# EAGLE schematic EEZ CF-DIC r5B5 (EAGLE 7.2.0)
Assembly variants: Farnell, TME

## Sheet 1 of 3
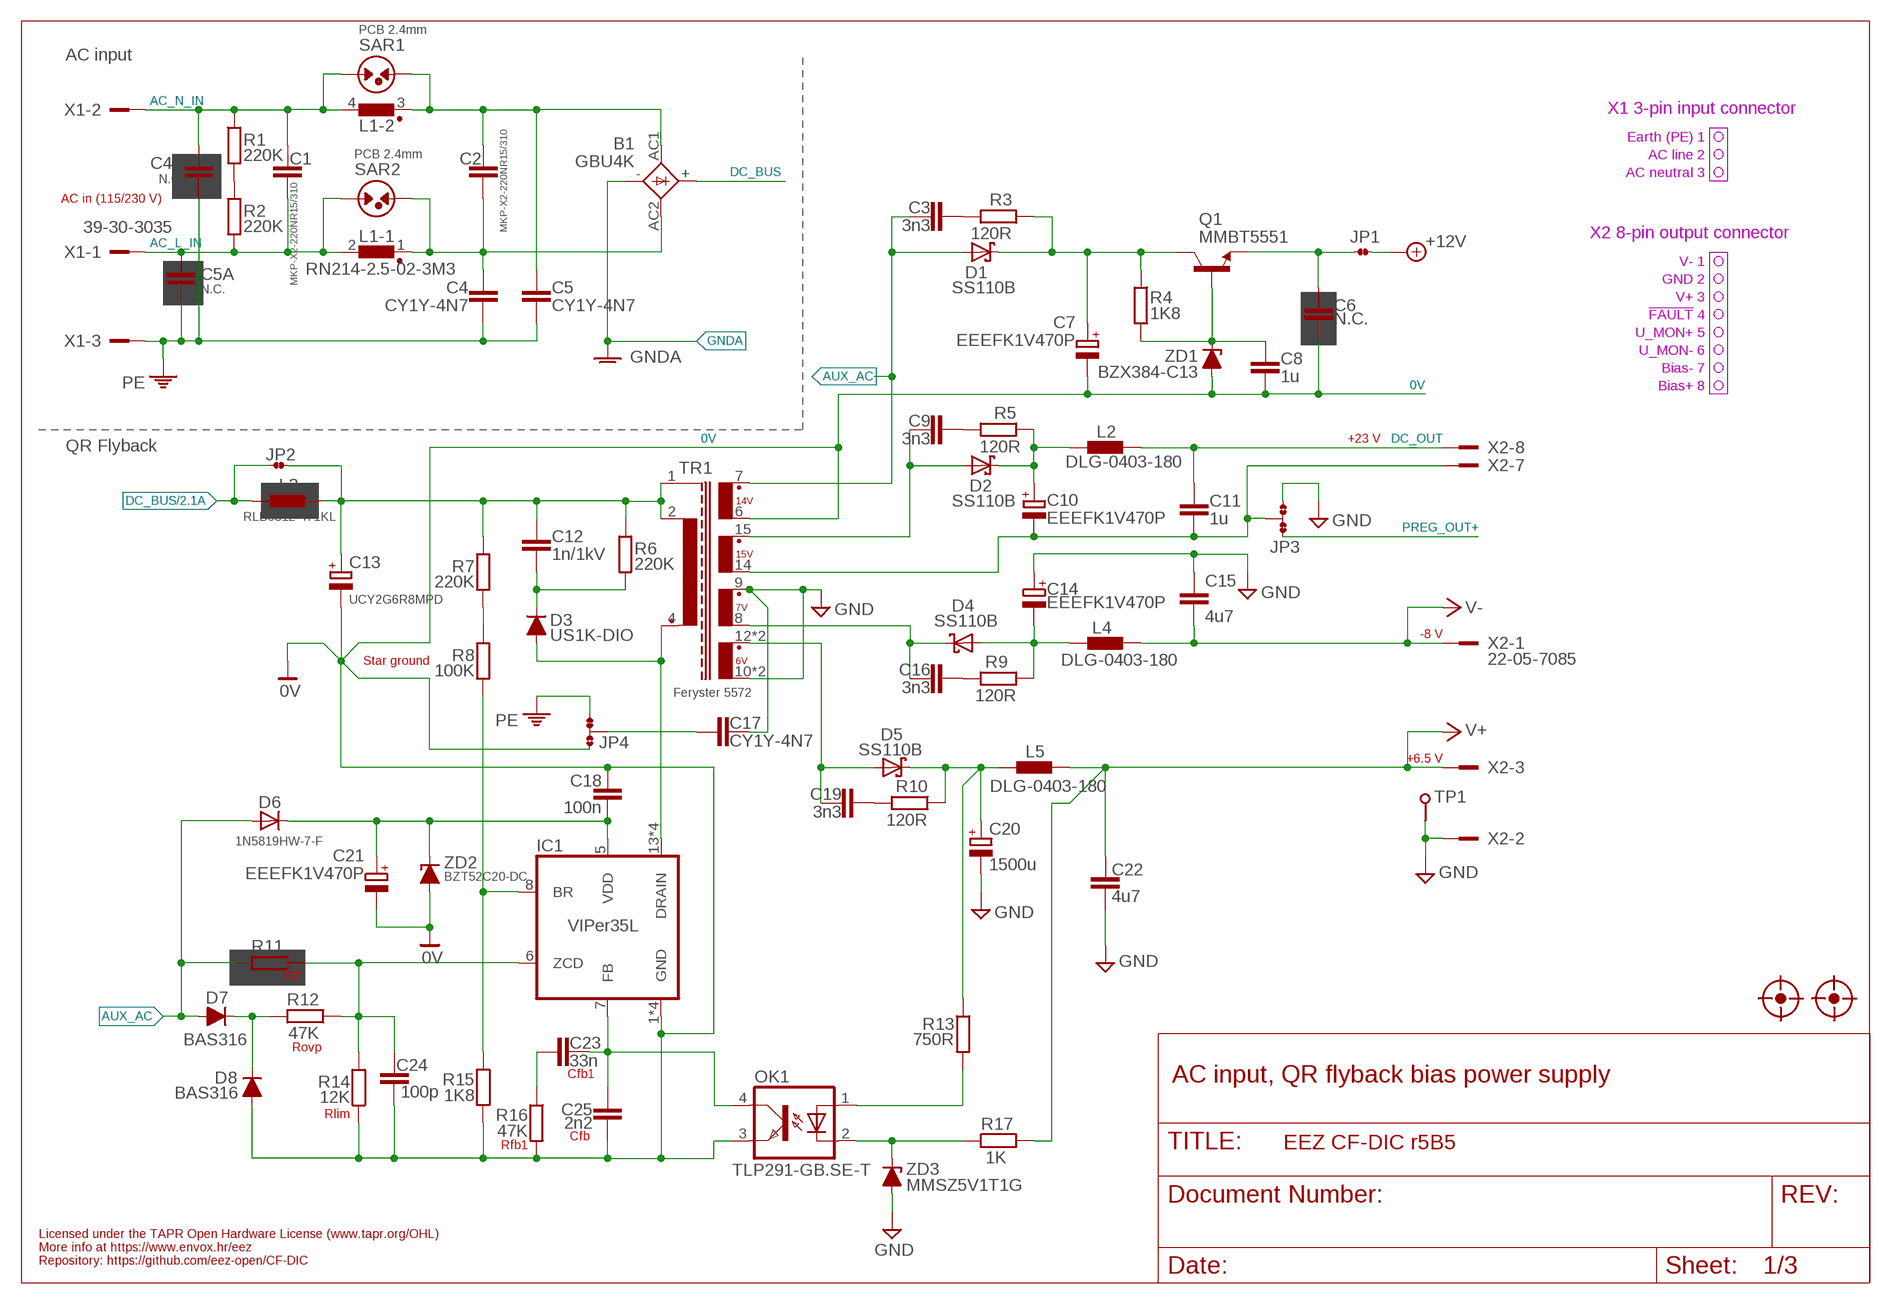
[diagram p0: schematic, sheet 1]

### Parts
B1  GBU4K  BRIDGE-CREEPAGE  [GBU4K_CRE]
C1  MKP-X2-220NR15/310  C-EU150-072X183  [C150-072X183]
C2  MKP-X2-220NR15/310  C-EU150-072X183  [C150-072X183]
C3  3n3  C-EUC0805  [C0805]
C4  CY1Y-4N7  C-EUCY  [CY075-032X103]
C4A  N.C.  C-EUCY-ROTATED  [CY075-032X103-ROTATED]
C5  CY1Y-4N7  C-EUCY  [CY075-032X103]
C5A  N.C.  C-EUCY  [CY075-032X103]
C6  N.C.  C-EUC0603  [C0603]
C7  EEEFK1V470P  ECAPPANASONIC_H  [CAPAE660X610N]
C8  1u  C-EUC0805  [C0805]
C9  3n3  C-EUC0805  [C0805]
C10  EEEFK1V470P  ECAPPANASONIC_H  [CAPAE660X610N]
C11  1u  C-EUC0805  [C0805]
C12  1n/1kV  C-EUC1210  [C1210]
C13  UCY2G6R8MPD  ECAP5G_10.5MM  [ECAP5/10.5]
C14  EEEFK1V470P  ECAPPANASONIC_H  [CAPAE660X610N]
C15  4u7  C-EUC1206  [C1206]
C16  3n3  C-EUC0805  [C0805]
C17  CY1Y-4N7  C-EUCY  [CY075-032X103]
C18  100n  C-EUC0603  [C0603]
C19  3n3  C-EUC0805  [C0805]
C20  1500u  ECAP5G_13MM  [ECAP5/13]
C21  EEEFK1V470P  ECAPPANASONIC_H  [CAPAE660X610N]
C22  4u7  C-EUC1206  [C1206]
C23  33n  C-EUC0805  [C0805]
C24  100p  C-EUC0805  [C0805]
C25  2n2  C-EUC0805  [C0805]
D1  SS110B  SCHOTTKYSMB  [SMB]
D2  SS110B  SCHOTTKYSMB  [SMB]
D3  US1K-DIO  DIODEDO214AA  [DO214AA]
D4  SS110B  SCHOTTKYSMB  [SMB]
D5  SS110B  SCHOTTKYSMB  [SMB]
D6  1N5819HW-7-F  DIODE-SOD323-W  [SOD323-W]
D7  BAS316  DIODESOD323R  [SOD323-R]
D8  BAS316  DIODESOD323R  [SOD323-R]
FM1  FIDUCIAL_2  [FIDUCIAL_DUAL]
FM2  FIDUCIAL_2  [FIDUCIAL_DUAL]
IC1  VIPer35L  VIPER35  [SOIC-16]
JP1  JP2-NOCUT  [JP2-NOCUT]
JP2  JP2-NOCUT  [JP2-NOCUT]
JP3  JP3-CUT  [JP3-CUT]
JP4  JP3-CUT  [JP3-CUT]
L1  RN214-2.5-02-3M3  RN214  [RN214]
L2  DLG-0403-180  DE0403  [DE0403]
L3  RLB0812-471KL  FERYSTER_DSZ6  [FERSYTER_DSZ6]
L4  DLG-0403-180  DE0403  [DE0403]
L5  DLG-0403-180  DE0403  [DE0403]
OK1  TLP291-GB.SE-T  TLP291  [SO4]
Q1  MMBT5551  MMBT5551LT1-NPN-SOT23-BEC  [SOT23-BEC]
R1  220K  R-EU_R1206  [R1206]
R2  220K  R-EU_R1206  [R1206]
R3  120R  R-EU_R0805  [R0805]
R4  1K8  R-EU_R0805  [R0805]
R5  120R  R-EU_R0805  [R0805]
R6  220K  R-EU_R1206  [R1206]
R7  220K  R-EU_R1206  [R1206]
R8  100K  R-EU_R0805  [R0805]
R9  120R  R-EU_R0805  [R0805]
R10  120R  R-EU_R0805  [R0805]
R11  N.C.  R-EU_R0805  [R0805]
R12  47K  R-EU_R0805  [R0805]
R13  750R  R-EU_R0805  [R0805]
R14  12K  R-EU_R0805  [R0805]
R15  1K8  R-EU_R0805  [R0805]
R16  47K  R-EU_R0805  [R0805]
R17  1K  R-EU_R0805  [R0805]
SAR1  PCB 2.4mm  SARPCB-2.4MM  [PCB-SAR_2.4MM]
SAR2  PCB 2.4mm  SARPCB-2.4MM  [PCB-SAR_2.4MM]
TP1  PCB_TEST_TABSHIELD  [PCB_SHIELD_TAB]
TR1  Feryster 5572  FERYSTER_5572  [FERYSTER_5572]
X1  39-30-3035  MINIFIT_6659-3-CRE  [MINIFIT_6659-3_CRE]
X2  22-05-7085  SPOX_22-05-7085  [SPOX_22-05-7085]
ZD1  BZX384-C13  ZENER-DIODESOD323  [SOD323-W]
ZD2  BZT52C20-DC  ZENER-DIODESOD123  [SOD123]
ZD3  MMSZ5V1T1G  ZENER-DIODESOD323  [SOD323-W]

### Nets
0V: C6.2 C7.2(-) C8.2 C13.- C18.1 C21.2(-) C24.2 C25.2 D8.A IC1.1(GND) IC1.2(GND) IC1.3(GND) IC1.4(GND) JP4.NO OK1.3(EMIT) R14.1 R15.2 R16.2 TR1.6(S_BIAS) ZD1.A ZD2.A ; also sheet 2
6VAC: C19.2 D5.A TR1.12(S1_DOT) TR1.13(S1_DOT)
7VAC: C16.2 D4.C TR1.8(S2)
15VAC: C9.2 D2.A TR1.15(S3_DOT)
+6V_REC: C20.+ D5.C L5.1 R10.1 R13.1
+12V: JP1.2 ; also sheet 2
+15V_REC: C10.1(+) D2.C L2.1 R5.1
-7V_REC: C14.2(-) D4.A L4.1 R9.1
-15V: C10.2(-) C11.2 JP3.COM TR1.14(S3) X2.7
AC_L_IN: C1.2 C5A.2 L1.2 R2.2 SAR2.1 X1.1
AC_N_IN: C1.1 C4A.2 L1.4 R1.1 SAR1.1 X1.2
AUX_AC: C3.2 D1.A D6.A D7.A R11.2 TR1.7(S_BIAS_DOT)
AUX_REC: C7.1(+) D1.C Q1.C R3.1 R4.1
DC_BUS: B1.+ JP2.1 L3.P$1 ; also sheet 2
DC_OUT: C11.1 L2.2 X2.8
FB2: OK1.2(C) R17.1 ZD3.C
GND: C14.1(+) C15.1 C17.2 C20.- C22.2 JP3.NO TP1.1 TR1.9(S2_DOT) TR1.10(S1) TR1.11(S1) X2.2 ZD3.A ; also sheet 2,3
GNDA: B1.- ; also sheet 2
N$4: C17.1 JP4.COM
N$20: IC1.8(BR) R8.2 R15.1
N$24: C6.1 JP1.1 Q1.E
N$27: C18.2 C21.1(+) D6.C IC1.5(VDD) ZD2.C
N$33: R1.2 R2.1
N$41: B1.AC1 C2.1 C5.2 L1.3 SAR1.2
N$43: B1.AC2 C2.2 C4.2 L1.1 SAR2.2
N$49: R7.2 R8.1
N$133: C8.1 Q1.B R4.2 ZD1.C
N$135: OK1.1(A) R13.2
N$137: C12.2 D3.C R6.2
N$138: C23.2 C25.1 IC1.7(FB) OK1.4(COL)
N$139: C9.1 R5.2
N$140: C3.1 R3.2
N$141: C24.1 IC1.6(ZCD) R11.1 R12.1 R14.2
N$144: C16.1 R9.2
N$146: C19.1 R10.2
N$152: C23.1 R16.1
N$155: D7.C D8.C R12.2
PE: C4.1 C4A.1 C5.1 C5A.1 JP4.NC X1.3 ; also sheet 3
PREG_OUT+: JP3.NC ; also sheet 3
V+: C22.1 L5.2 R17.2 X2.3 ; also sheet 3
V-: C15.2 L4.2 X2.1 ; also sheet 3
VIPER+: C12.1 C13.+ JP2.2 L3.P$2 R6.1 R7.1 TR1.1(SHIELD) TR1.2(P)
VIPER_D: D3.A IC1.13(DRAIN) IC1.14(DRAIN) IC1.15(DRAIN) IC1.16(DRAIN) TR1.4(P2_DOT)

### Notes on the sheet
- AC input
- X1 3-pin input connector
- Earth (PE) 1
- AC line 2
- AC neutral 3
- AC in (115/230 V)
- X2 8-pin output connector
- V- 1
- GND 2
- V+ 3
- !FAULT! 4
- U_MON+ 5
- U_MON- 6
- Bias- 7
- Bias+ 8
- +23 V
- QR Flyback
- -8 V
- Star ground
- +6.5 V
- Rff
- Rovp
- Cfb1
- AC input, QR flyback bias power supply
- Rlim
- Cfb
- Rfb1
- Licensed under the TAPR Open Hardware License (www.tapr.org/OHL)
- More info at https://www.envox.hr/eez
- Repository: https://github.com/eez-open/CF-DIC

## Sheet 2 of 3
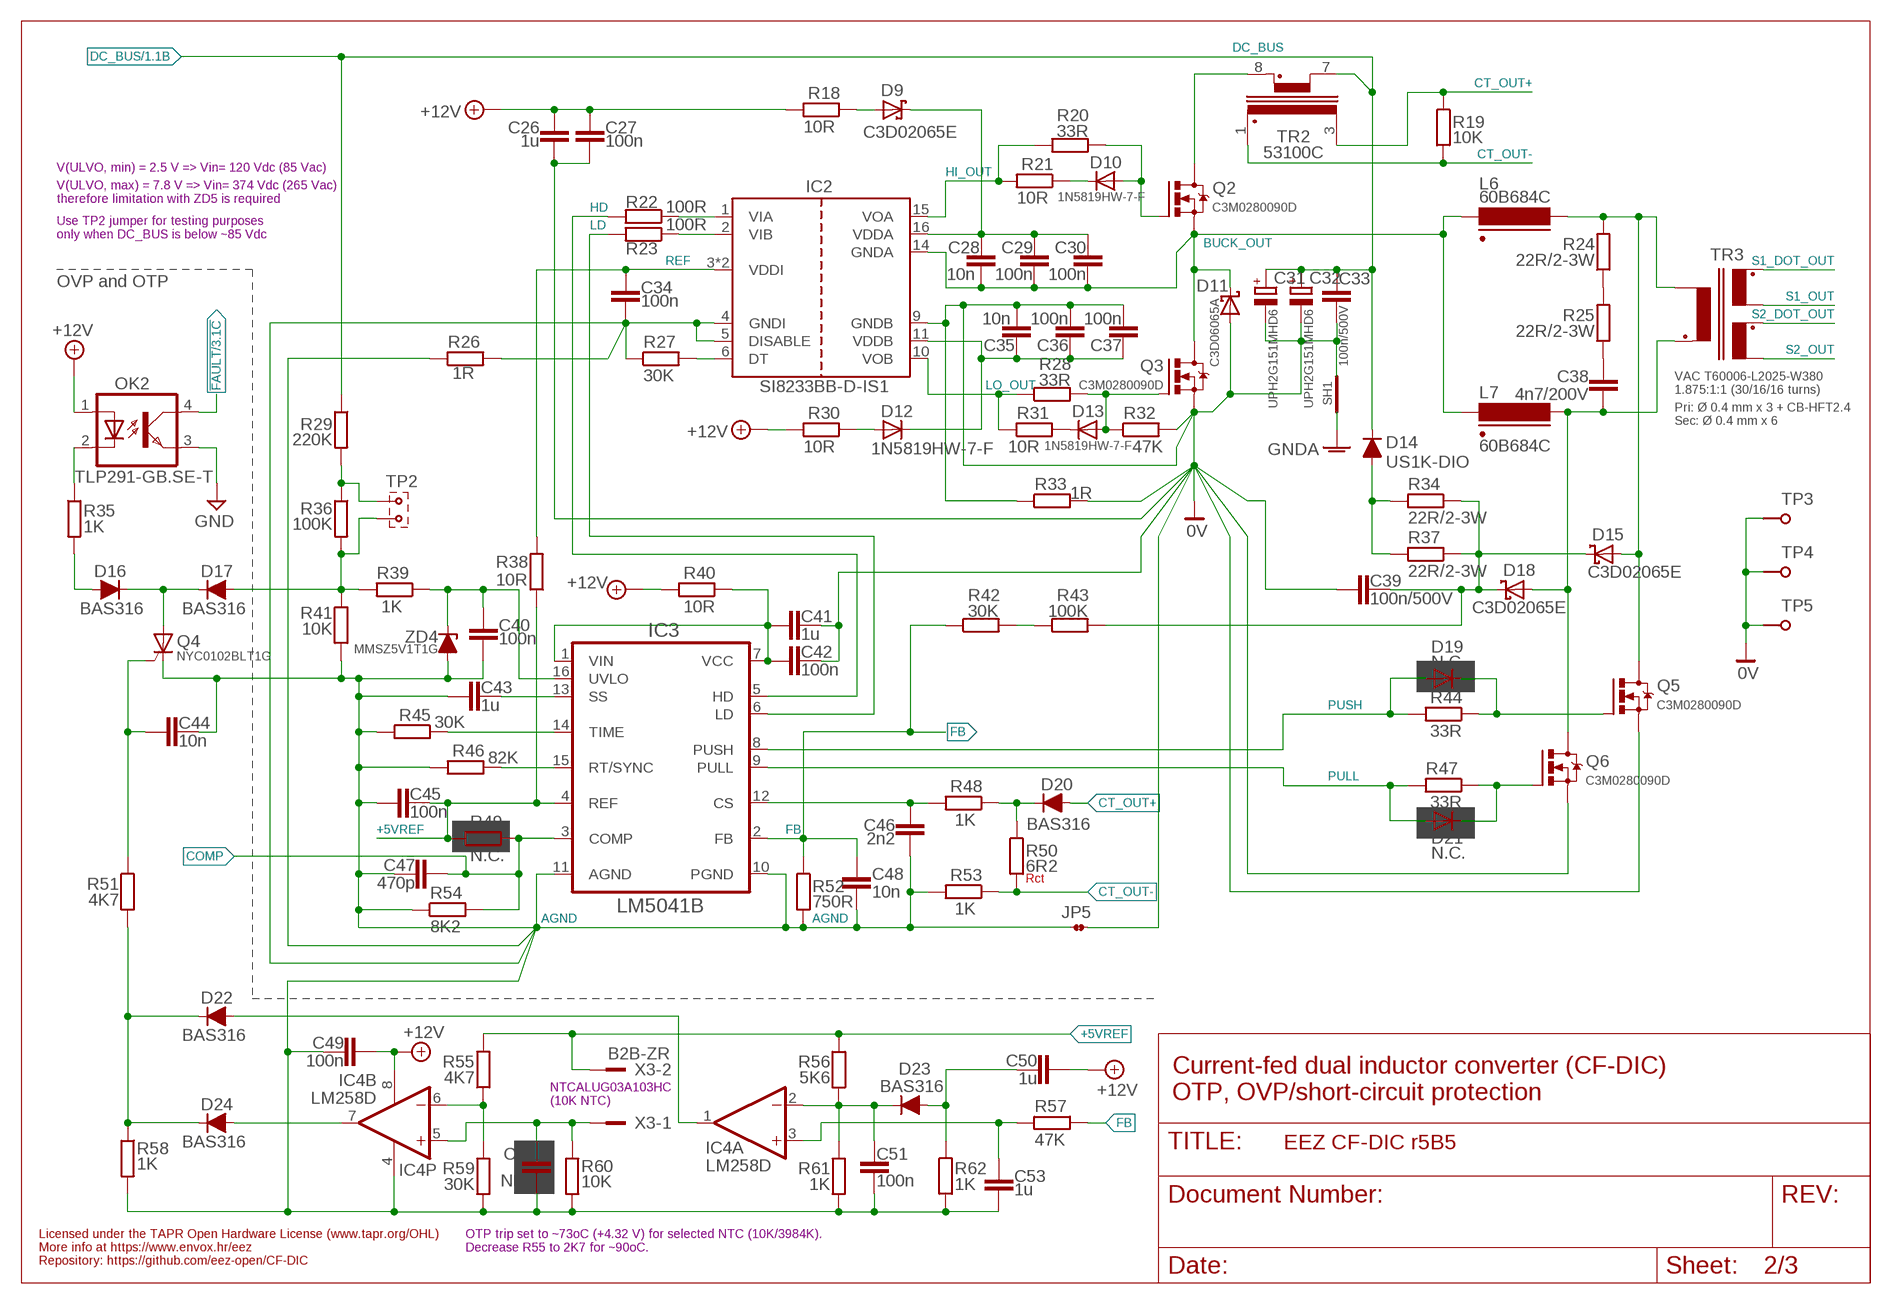
[diagram p1: schematic, sheet 2]

### Parts
C26  1u  C-EUC0805  [C0805]
C27  100n  C-EUC0603  [C0603]
C28  10n  C-EUC0603  [C0603]
C29  100n  C-EUC0603  [C0603]
C30  100n  C-EUC0603  [C0603]
C31  UPH2G151MHD6  ECAP7.5G_18MM  [ECAP7.5/18]
C32  UPH2G151MHD6  ECAP7.5G_18MM  [ECAP7.5/18]
C33  100n/500V  C-EUC1812  [C1812]
C34  100n  C-EUC0603  [C0603]
C35  10n  C-EUC0603  [C0603]
C36  100n  C-EUC0603  [C0603]
C37  100n  C-EUC0603  [C0603]
C38  4n7/200V  C-EUC1210  [C1210]
C39  100n/500V  C-EUC1812  [C1812]
C40  100n  C-EUC0603  [C0603]
C41  1u  C-EUC0805  [C0805]
C42  100n  C-EUC0603  [C0603]
C43  1u  C-EUC0805  [C0805]
C44  10n  C-EUC0603  [C0603]
C45  100n  C-EUC0603  [C0603]
C46  2n2  C-EUC0805  [C0805]
C47  470p  C-EUC0805  [C0805]
C48  10n  C-EUC0603  [C0603]
C49  100n  C-EUC0603  [C0603]
C50  1u  C-EUC0805  [C0805]
C51  100n  C-EUC0603  [C0603]
C52  N.C.  C-EUC0603  [C0603]
C53  1u  C-EUC0805  [C0805]
D9  C3D02065E  SCHOTTKY-SIC  [TO252]
D10  1N5819HW-7-F  DIODE-SOD323-W  [SOD323-W]
D11  C3D06065A  SCHOTTKY-TO220  [TO220-2]
D12  1N5819HW-7-F  DIODE-SOD323-W  [SOD323-W]
D13  1N5819HW-7-F  DIODE-SOD323-W  [SOD323-W]
D14  US1K-DIO  DIODEDO214AA  [DO214AA]
D15  C3D02065E  SCHOTTKY-SIC  [TO252]
D16  BAS316  DIODESOD323R  [SOD323-R]
D17  BAS316  DIODESOD323R  [SOD323-R]
D18  C3D02065E  SCHOTTKY-SIC  [TO252]
D19  N.C.  DIODE-SOD323-W  [SOD323-W]
D20  BAS316  DIODESOD323R  [SOD323-R]
D21  N.C.  DIODE-SOD323-W  [SOD323-W]
D22  BAS316  DIODESOD323R  [SOD323-R]
D23  BAS316  DIODESOD323R  [SOD323-R]
D24  BAS316  DIODESOD323R  [SOD323-R]
IC2  SI8233BB-D-IS1  SI8233  [SOIC-16]
IC3  LM5041B  LM5041  [MTC16]
IC4  LM258D  TL072SOIC8  [SOIC127P600X173-8N]
JP5  JP2-NOCUT  [JP2-NOCUT]
L6  60B684C  MURATA_6000B  [MURATA_6000B]
L7  60B684C  MURATA_6000B  [MURATA_6000B]
OK2  TLP291-GB.SE-T  TLP291  [SO4]
Q2  C3M0280090D  IRFP240  [TO247BV]
Q3  C3M0280090D  IRFP240  [TO247BV]
Q4  NYC0102BLT1G  [SOT23]
Q5  C3M0280090D  IRFP240  [TO247BV]
Q6  C3M0280090D  IRFP240  [TO247BV]
R18  10R  R-EU_R0805  [R0805]
R19  10K  R-EU_R0805  [R0805]
R20  33R  R-EU_R0805  [R0805]
R21  10R  R-EU_R0805  [R0805]
R22  100R  R-EU_R0805  [R0805]
R23  100R  R-EU_R0805  [R0805]
R24  22R/2-3W  R-EU_R2512  [R2512]
R25  22R/2-3W  R-EU_R2512  [R2512]
R26  1R  R-EU_R0805  [R0805]
R27  30K  R-EU_R0805  [R0805]
R28  33R  R-EU_R0805  [R0805]
R29  220K  R-EU_R1206  [R1206]
R30  10R  R-EU_R0805  [R0805]
R31  10R  R-EU_R0805  [R0805]
R32  47K  R-EU_R0805  [R0805]
R33  1R  R-EU_R0805  [R0805]
R34  22R/2-3W  R-EU_R2512  [R2512]
R35  1K  R-EU_R0805  [R0805]
R36  100K  R-EU_R0805  [R0805]
R37  22R/2-3W  R-EU_R2512  [R2512]
R38  10R  R-EU_R0805  [R0805]
R39  1K  R-EU_R0805  [R0805]
R40  10R  R-EU_R0805  [R0805]
R41  10K  R-EU_R0805  [R0805]
R42  30K  R-EU_R0805  [R0805]
R43  100K  R-EU_R0805  [R0805]
R44  33R  R-EU_R0805  [R0805]
R45  30K  R-EU_R0805  [R0805]
R46  82K  R-EU_R0805  [R0805]
R47  33R  R-EU_R0805  [R0805]
R48  1K  R-EU_R0805  [R0805]
R49  N.C.  R-EU_R0805  [R0805]
R50  6R2  R-EU_R0805  [R0805]
R51  4K7  R-EU_R0805  [R0805]
R52  750R  R-EU_R0805  [R0805]
R53  1K  R-EU_R0805  [R0805]
R54  8K2  R-EU_R0805  [R0805]
R55  4K7  R-EU_R0805  [R0805]
R56  5K6  R-EU_R0805  [R0805]
R57  47K  R-EU_R0805  [R0805]
R58  1K  R-EU_R0805  [R0805]
R59  30K  R-EU_R0805  [R0805]
R60  10K  R-EU_R0805  [R0805]
R61  1K  R-EU_R0805  [R0805]
R62  1K  R-EU_R0805  [R0805]
SH1  SHORTNOHOLE  [SHORT_NOHOLE]
TP2  JUMPER-2PIN-2MM  [2MM-2]
TP3  TEST-PIN1.2  [TEST-PIN_1.2MM]
TP4  TEST-PIN1.2  [TEST-PIN_1.2MM]
TP5  TEST-PIN1.2  [TEST-PIN_1.2MM]
TR2  53100C  MURATA_5300  [MURATA_5300]
TR3  VAC T60006-L2025-W380  PCB_TRAFO_FLYBACK2-VAC  [VAC_DUAL_SEC]
X3  B2B-ZR  [B2B-ZR]
ZD4  MMSZ5V1T1G  ZENER-DIODESOD323  [SOD323-W]

### Nets
0V: C26.1 C27.1 C31.- C32.- C33.2 C35.2 C36.2 C37.2 C39.1 C41.2 C42.2 D11.2(A) IC2.9(GNDB) JP5.2 Q3.S Q5.S Q6.S R32.2 R33.1 R33.2 SH1.P$2(GND_B) TP3.1 TP4.1 TP5.1 ; also sheet 1
!FAULT: OK2.4(COL) ; also sheet 3
+5VREF: C45.2 IC3.4(REF) R38.1 R49.1 R55.2 R56.2 X3.2
+12V: C26.2 C27.2 C49.1 C50.1 IC4.8(P:V+) OK2.1(A) R18.2 R30.2 R40.2 ; also sheet 1
AGND: C34.1 C40.2 C43.1 C44.2 C45.1 C46.1 C47.1 C48.2 C49.2 C51.2 C52.1 C53.1 IC2.4(GNDI) IC2.5(DISABLE) IC3.10(PGND) IC3.11(AGND) IC4.4(P:V-) JP5.1 Q4.1(C) R26.1 R26.2 R27.1 R41.2 R45.2 R46.2 R52.2 R53.2 R54.1 R58.2 R59.2 R60.2 R61.2 R62.2 ZD4.A ; also sheet 3
BUCK_OUT: C28.2 C29.2 C30.2 D11.1(C) IC2.14(GNDA) L6.2 L7.2 Q2.S Q3.D
CLAMP_C: C39.2 D15.1(C) D15.3(C) D18.1(C) D18.3(C) R34.1 R37.1 R43.2
COMP: C47.2 IC3.3(COMP) R49.2 R54.2 ; also sheet 3
CT_OUT+: D20.A R19.1 TR2.3(S)
CT_OUT-: R19.2 R50.2 R53.1 TR2.1(S_DOT)
DC_BUS: C31.+ C32.+ C33.1 D14.C R29.1 TR2.7(P) ; also sheet 1
FB: C48.1 IC3.2(FB) R42.1 R52.1 R57.1
GND: OK2.3(EMIT) ; also sheet 1,3
GNDA: SH1.P$1(GND_A) ; also sheet 1
HD: IC3.5(HD) R22.2
HI_OUT: IC2.15(VOA) R20.2 R21.2
L_PULL: C38.2 D18.2(A) L7.1 Q6.D TR3.P1_DOT(P_DOT)
L_PUSH: D15.2(A) L6.1 Q5.D R24.2 TR3.P1(P)
LD: IC3.6(LD) R23.2
LO_OUT: IC2.10(VOB) R28.1 R31.1
N$2: R29.2 R36.1 TP2.1
N$3: C28.1 C29.1 C30.1 D9.1(C) D9.3(C) IC2.16(VDDA)
N$5: R24.1 R25.2
N$7: C51.1 D23.C IC4.2(A:-IN) R56.1 R61.1
N$13: D19.C Q5.G R44.1
N$14: D21.C Q6.G R47.1
N$15: Q2.D TR2.8(P_DOT)
N$17: C38.1 R25.1
N$19: IC3.15(RT/SYNC) R46.1
N$21: D10.A Q2.G R20.1
N$22: IC3.14(TIME) R45.1
N$23: C43.2 IC3.13(SS)
N$25: C40.1 IC3.16(UVLO) R39.1 ZD4.C
N$26: IC4.6(B:-IN) R55.1 R59.1
N$29: D13.A Q3.G R28.2 R32.1
N$30: R42.2 R43.1
N$31: D9.2(A) R18.1
N$32: OK2.2(C) R35.1
N$34: C53.2 IC4.3(A:+IN) R57.2
N$35: D14.A R34.2 R37.2
N$36: IC2.1(VIA) R22.1
N$37: C46.2 IC3.12(CS) R48.2
N$38: D22.A IC4.1(A:OUT)
N$40: IC2.2(VIB) R23.1
N$42: C52.2 IC4.5(B:+IN) R60.1 X3.1
N$45: D10.C R21.1
N$47: D24.A IC4.7(B:OUT)
N$48: IC2.6(DT) R27.2
N$51: D22.C D24.C R51.2 R58.1
N$52: D13.C R31.2
N$54: C41.1 C42.1 IC3.1(VIN) IC3.7(VCC) R40.1
N$55: C35.1 C36.1 C37.1 D12.C IC2.11(VDDB)
N$56: D20.C R48.1 R50.1
N$59: C50.2 D23.A R62.1
N$63: D12.A R30.1
N$100: C44.1 Q4.2(G) R51.1
N$126: D16.C D17.C Q4.3(A)
N$130: D16.A R35.2
PULL: D21.A IC3.9(PULL) R47.2
PUSH: D19.A IC3.8(PUSH) R44.2
REF: C34.2 IC2.3(VDDI) IC2.8(VDDI) R38.2
S1_DOT_OUT: TR3.S1_DOT ; also sheet 3
S1_OUT: TR3.S1 ; also sheet 3
S2_DOT_OUT: TR3.S2_DOT ; also sheet 3
S2_OUT: TR3.S2 ; also sheet 3
ULVO: D17.A R36.2 R39.2 R41.1 TP2.2

### Notes on the sheet
- V(ULVO, min) = 2.5 V => Vin= 120 Vdc (85 Vac)
- V(ULVO, max) = 7.8 V => Vin= 374 Vdc (265 Vac)
  therefore limitation with ZD5 is required
- Use TP2 jumper for testing purposes
  only when DC_BUS is below ~85 Vdc
- OVP and OTP
- 1.875:1:1 (30/16/16 turns)
- Pri: Ø 0.4 mm x 3 + CB-HFT2.4
- Sec: Ø 0.4 mm x 6
- Rct
- Current-fed dual inductor converter (CF-DIC)
  OTP, OVP/short-circuit protection
- NTCALUG03A103HC
  (10K NTC)
- OTP trip set to ~73oC (+4.32 V) for selected NTC (10K/3984K).
  Decrease R55 to 2K7 for ~90oC.
- Licensed under the TAPR Open Hardware License (www.tapr.org/OHL)
- More info at https://www.envox.hr/eez
- Repository: https://github.com/eez-open/CF-DIC

## Sheet 3 of 3
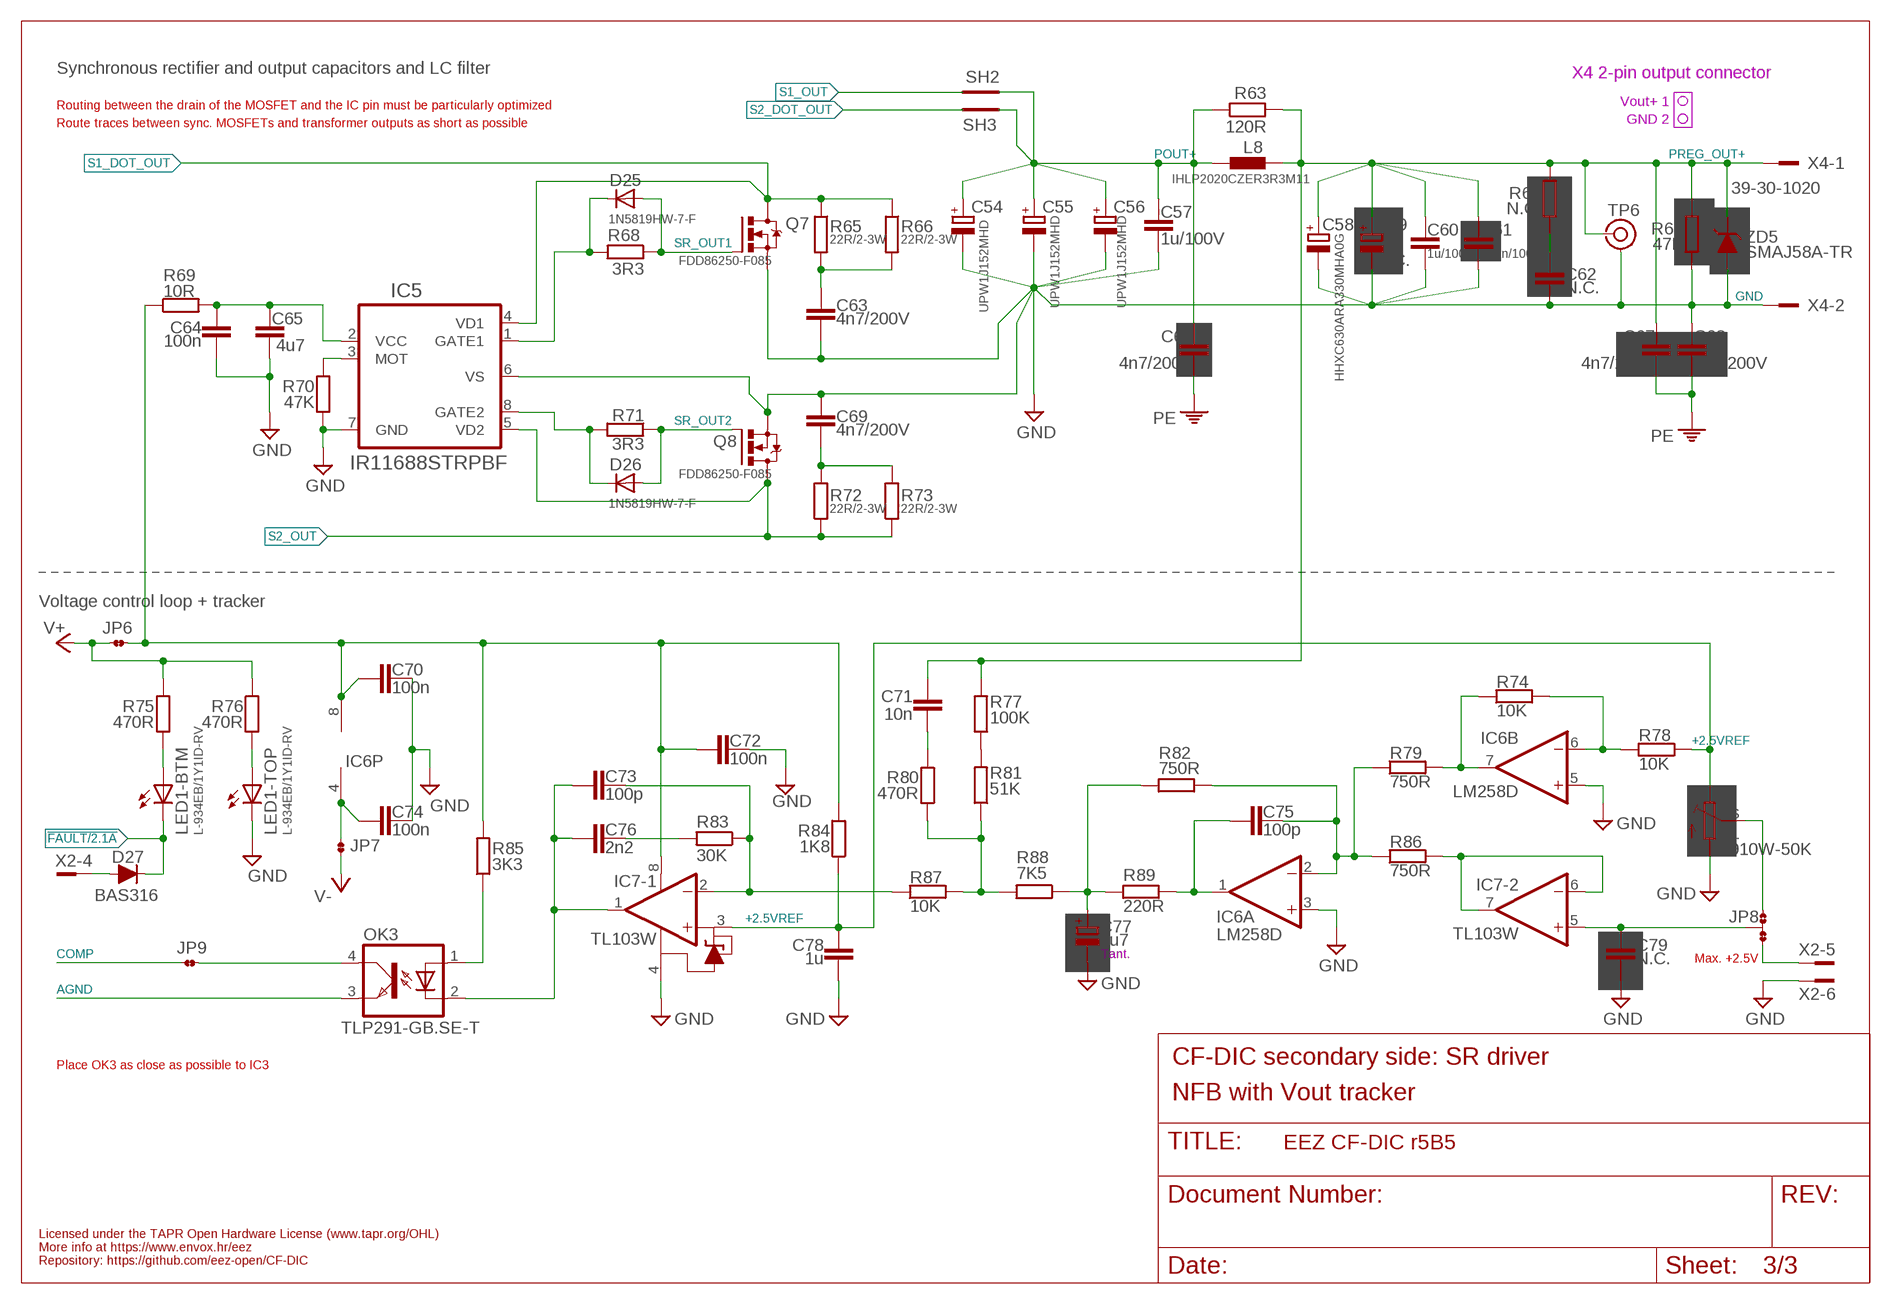
[diagram p2: schematic, sheet 3]

### Parts
C54  UPW1J152MHD  ECAP7.5G_18MM  [ECAP7.5/18]
C55  UPW1J152MHD  ECAP7.5G_18MM  [ECAP7.5/18]
C56  UPW1J152MHD  ECAP7.5G_18MM  [ECAP7.5/18]
C57  1u/100V  C-EUC1206  [C1206]
C58  HHXC630ARA330MHA0G  ECAPSMD8.3MM/HA0  [CAPAE830X1050N]
C59  N.C.  ECAPSMD8.3MM/HA0  [CAPAE830X1050N]
C60  1u/100V  C-EUC1206  [C1206]
C61  100n/100V  C-EUC1206  [C1206]
C62  N.C.  C-EUC1206  [C1206]
C63  4n7/200V  C-EUC1206  [C1206]
C64  100n  C-EUC0603  [C0603]
C65  4u7  C-EUC1206  [C1206]
C66  4n7/200V  C-EUC1206  [C1206]
C67  4n7/200V  C-EUC1206  [C1206]
C68  4n7/200V  C-EUC1206  [C1206]
C69  4n7/200V  C-EUC1206  [C1206]
C70  100n  C-EUC0603  [C0603]
C71  10n  C-EUC0603  [C0603]
C72  100n  C-EUC0603  [C0603]
C73  100p  C-EUC0805  [C0805]
C74  100n  C-EUC0603  [C0603]
C75  100p  C-EUC0805  [C0805]
C76  2n2  C-EUC0805  [C0805]
C77  4u7  ECAP1206  [EC1206]
C78  1u  C-EUC0805  [C0805]
C79  N.C.  C-EUC0805  [C0805]
D25  1N5819HW-7-F  DIODE-SOD323-W  [SOD323-W]
D26  1N5819HW-7-F  DIODE-SOD323-W  [SOD323-W]
D27  BAS316  DIODESOD323R  [SOD323-R]
IC5  IR11688STRPBF  IR11688  [SO8]
IC6  LM258D  TL072SOIC8  [SOIC127P600X173-8N]
IC7  TL103W  [SOIC127P600X173-8N]
JP6  JP2-NOCUT  [JP2-NOCUT]
JP7  JP2-NOCUT  [JP2-NOCUT]
JP8  JP3-CUT  [JP3-CUT]
JP9  JP2-NOCUT  [JP2-NOCUT]
L8  IHLP2020CZER3R3M11  IHLP-2020BZ-11  [IHLP-2020BZ-11]
LED1  L-934EB/1Y1ID-RV  LED_L-934EB/1Y1ID-RV  [L-934EB]
OK3  TLP291-GB.SE-T  TLP291  [SO4]
P1  T910W-50K  TPOT-S64W  [S64W]
Q7  FDD86250-F085  N-MOSFETTO263  [TO263]
Q8  FDD86250-F085  N-MOSFETTO263  [TO263]
R63  120R  R-EU_R0805  [R0805]
R64  N.C.  R-EU_R1210  [R1210]
R65  22R/2-3W  R-EU_R2512  [R2512]
R66  22R/2-3W  R-EU_R2512  [R2512]
R67  47K  R-EU_R0805  [R0805]
R68  3R3  R-EU_R0805  [R0805]
R69  10R  R-EU_R0805  [R0805]
R70  47K  R-EU_R0805  [R0805]
R71  3R3  R-EU_R0805  [R0805]
R72  22R/2-3W  R-EU_R2512  [R2512]
R73  22R/2-3W  R-EU_R2512  [R2512]
R74  10K  R-EU_R0805  [R0805]
R75  470R  R-EU_R0805  [R0805]
R76  470R  R-EU_R0805  [R0805]
R77  100K  R-EU_R0805  [R0805]
R78  10K  R-EU_R0805  [R0805]
R79  750R  R-EU_R0805  [R0805]
R80  470R  R-EU_R0805  [R0805]
R81  51K  R-EU_R0805  [R0805]
R82  750R  R-EU_R0805  [R0805]
R83  30K  R-EU_R0805  [R0805]
R84  1K8  R-EU_R0805  [R0805]
R85  3K3  R-EU_R0805  [R0805]
R86  750R  R-EU_R0805  [R0805]
R87  10K  R-EU_R0805  [R0805]
R88  7K5  R-EU_R0805  [R0805]
R89  220R  R-EU_R0805  [R0805]
SH2  SHORTNOHOLE  [SHORT_NOHOLE]
SH3  SHORTNOHOLE  [SHORT_NOHOLE]
TP6  TEST_POINT-2  [TP_1.1MM_2]
X4  39-30-1020  MINIFIT_39301020  [MINIFIT_39301020]
ZD5  SMAJ58A-TR  PSMAXX  [DO214AC]

### Nets
!FAULT: D27.C LED1.BC(-BTM:C) ; also sheet 2
+2.5VREF: C78.1 IC7.3(-1:+IN1) P1.E R78.2 R84.1
AGND: OK3.3(EMIT) ; also sheet 2
COMP: JP9.1 ; also sheet 2
GND: C54.- C55.- C56.- C57.2 C58.- C59.- C60.2 C61.2 C62.1 C63.2 C64.2 C65.2 C68.1 C69.2 C70.2 C72.2 C74.2 C77.- C78.2 C79.2 IC5.6(VS) IC5.7(GND) IC6.3(A:+IN) IC6.5(B:+IN) IC7.4(-1:VCC-) LED1.TC(-TOP:C) P1.A Q7.2(S) Q8.2(S) R67.1 R70.2 TP6.GND X2.6 X4.2 ZD5.A ; also sheet 1,2
N$1: D27.A X2.4
N$6: C64.1 C65.1 IC5.2(VCC) R69.2
N$8: C62.2 R64.1
N$9: C76.2 R83.2
N$10: C73.2 IC7.2(-1:-IN1) R83.1 R87.1
N$11: LED1.TA(-TOP:A) R76.2
N$12: R77.1 R81.2
N$16: LED1.BA(-BTM:A) R75.2
N$18: IC5.3(MOT) R70.1
N$28: C71.2 R80.2
N$39: C74.1 IC6.4(P:V-) JP7.1
N$44: JP9.2 OK3.4(COL)
N$46: C70.1 C72.1 IC6.8(P:V+) IC7.8(-1:VCC+) JP6.2 R69.1 R84.2 R85.2
N$50: R80.1 R81.1 R87.2 R88.2
N$53: IC6.7(B:OUT) R74.1 R79.2
N$57: C79.1 IC7.5(-2:+IN) JP8.COM
N$58: JP8.NO P1.S
N$64: C75.2 IC6.2(A:-IN) R79.1 R82.2 R86.1
N$66: C63.1 R65.2 R66.2
N$67: C69.1 R72.2 R73.2
N$74: D25.C IC5.1(GATE1) R68.2
N$75: D26.C IC5.8(GATE2) R71.2
N$76: C73.1 C76.1 IC7.1(-1:OUT1) OK3.2(C)
N$132: IC6.6(B:-IN) R74.2 R78.1
N$134: C75.1 IC6.1(A:OUT) R89.2
NFB_OFFSET: C77.+ R82.1 R88.1 R89.1
OK_A: OK3.1(A) R85.1
PE: C66.2 C67.2 C68.2 ; also sheet 1
POUT+: C54.+ C55.+ C56.+ C57.1 C66.1 L8.1 R63.1 SH2.P$2(GND_B) SH3.P$1(GND_A)
PREG_OUT+: C58.+ C59.+ C60.1 C61.1 C67.1 C71.1 L8.2 R63.2 R64.2 R67.2 R77.2 TP6.TIP X4.1 ZD5.C ; also sheet 1
S1_DOT_OUT: IC5.4(VD1) Q7.3(D) R65.1 R66.1 ; also sheet 2
S1_OUT: SH2.P$1(GND_A) ; also sheet 2
S2_DOT_OUT: SH3.P$2(GND_B) ; also sheet 2
S2_OUT: IC5.5(VD2) Q8.3(D) R72.1 R73.1 ; also sheet 2
SR_OUT1: D25.A Q7.1(G) R68.1
SR_OUT2: D26.A Q8.1(G) R71.1
U_MON: JP8.NC X2.5
U_MON1: IC7.6(-2:-IN) IC7.7(-2:OUT) R86.2
V+: JP6.1 R75.1 R76.1 ; also sheet 1
V-: JP7.2 ; also sheet 1

### Notes on the sheet
- Synchronous rectifier and output capacitors and LC filter | X4 2-pin output connector
- Vout+ 1
- Routing between the drain of the MOSFET and the IC pin must be particularly optimized
- GND 2
- Route traces between sync. MOSFETs and transformer outputs as short as possible
- Voltage control loop + tracker
- Max. +2.5V
- Tant.
- CF-DIC secondary side: SR driver
- Place OK3 as close as possible to IC3
- NFB with Vout tracker
- Licensed under the TAPR Open Hardware License (www.tapr.org/OHL)
- More info at https://www.envox.hr/eez
- Repository: https://github.com/eez-open/CF-DIC

## Library data of the parts
B1 = EEZ_Lib1:BRIDGE
C1-C3 C6 C8 C9 C11 C12 C15 C16 C18 C19 C22-C30 C33-C53 C57 C60-C76 C78 C79 = rcl:C-EU: CAPACITOR, European symbol
C4 C4A C5 C5A C17 = EEZ_Lib1:C-EU
C7 C10 C13 C14 C20 C21 C31 C32 C54-C56 C58 C59 C77 = EEZ_Lib1:ECAP
D1 D2 D4 D5 D9 D11 D15 D18 = EEZ_Lib1:SCHOTTKY
D3 D7 D8 D14 D16 D17 D20 D22-D24 D27 = EEZ_Lib1:DIODE
D6 D10 D12 D13 D19 D21 D25 D26 = diode:DIODE-: DIODE
FM1 FM2 = EEZ_Lib1:FIDUCIAL: Fiducial mark for pick and place automation
IC1 = EEZ_Lib1:VIPER35: Quasi-resonant high performance off line high voltage converter, 800 V
IC2 = EEZ_Lib1:SI8233: Dual 4.0 Amp ISOdrivers with deadtime control and overlap protection
IC3 = EEZ_Lib1:LM5041: Cascaded PWM Controller; MANUFACTURER_PART_NUMBER: lm5041mtcnopb; VENDOR: TI
IC4 IC6 = EEZ_Lib1:TL072
IC5 = EEZ_Lib1:IR11688: Dual smart rectifier driver IC with programmable MOT
IC7 = EEZ_Lib1:TL103W: Dual Operational Amplifiers With Internal Reference
JP1 JP2 JP5-JP7 JP9 = EEZ_Lib1:JP2-NOCUT
JP3 JP4 JP8 = EEZ_Lib1:JP3-CUT
L1 = EEZ_inductors_and_transformers:RN214: Schaffner EMC/EMI current-compensated chokes, vertical case; FARNELL: 1191518
L2 L4 L5 = EEZ_inductors_and_transformers:DE0403: Ferrocore SMD power coil 4.0 x 4.5 mm
L3 = EEZ_Lib1:FERYSTER_DSZ6: Feryster DSZ type choke on RSZ ferrite core
L6 L7 = EEZ_inductors_and_transformers:MURATA_6000B: Surface Mount Power Inductors (47μH to 680μH)
L8 = EEZ_inductors_and_transformers:IHLP-2020BZ-11: Low Profile, High Current IHLP® Inductors
LED1 = EEZ_Lib1:LED_L-934EB: Kingbright Electronic LED x 2; in housing; 3mm; 20mA; Lens: diffused
OK1-OK3 = EEZ_Lib1:TLP291: Toshiba Photocopler GaAs IRED & Photo-transistor
P1 = EEZ_Lib1:TPOT
Q1 = transistor:*-NPN-: NPN Transistror BF959 corrected 2008.03.06
Q2 Q3 Q5 Q6 = EEZ_Lib1:IRFP240: N-channel MOSFET (TO-247)
Q4 = EEZ_Lib1:NYC0102BLT1G: Surface Mount Thyristor, High dv/dt, 200V
Q7 Q8 = EEZ_Lib1:N-MOSFET
R1-R89 = rcl:R-EU_: RESISTOR, European symbol
SAR1 SAR2 = EEZ_Lib1:SAR: EPCOS surge arrester EF470X Farnell: 1886596
SH1-SH3 = EEZ_Lib1:SHORT
TP1 = EEZ_Lib1:PCB_TEST_TAB
TP2 = EEZ_Lib1:JUMPER-2PIN
TP3-TP5 = EEZ_connectors:TEST-PIN: Test pin
TP6 = EEZ_Lib1:TEST_POINT: Test point for oscilloscope probe
TR1 = EEZ_inductors_and_transformers:FERYSTER_5572: Feryster custom for QR Flyback with VIPer35
TR2 = EEZ_inductors_and_transformers:MURATA_5300: 10A Current sensing transformers
TR3 = EEZ_inductors_and_transformers:PCB_TRAFO_FLYBACK2: PCB flyback transformer, dual secondary, no AUX
X1 = EEZ_connectors:MINIFIT_6659-3: MOLEX 39303035 Wire-To-Board Connector, Single In Line, Mini-Fit Jr 5569 Series, 3 Contacts, Plug, 4.2 mm
X2 = EEZ_connectors:SPOX_22-05-7085: Molex socket; wire-board; male; SPOX; 2.5mm; PIN:8; THT; 3A; tinned; 250V
X3 = EEZ_Lib1:B2B-ZR: JST Socket; wire-board; male; ZH; 1.5mm; PIN:2; THT; 50V; 1A
X4 = EEZ_connectors:MINIFIT_39301020: Molex Socket; wire-board; male; Mini-Fit Jr; 4.2mm; PIN:2; THT; PCB snap
ZD1-ZD4 = EEZ_Lib1:ZENER-DIODE
ZD5 = EEZ_Lib1:PSMAXX: Transient Voltage Suppressor, TVS, P4SMA Series, Unidirectional

## Net classes
0 default: width 0.203 mm, drill 0.4 mm, clearance 0.203 mm
2 gnd: width 0.254 mm, drill 0.4 mm, clearance 0.152 mm to class 0, clearance 0.152 mm to class 1, clearance 0.152 mm